# Altium project CoproMKII.PrjPcb
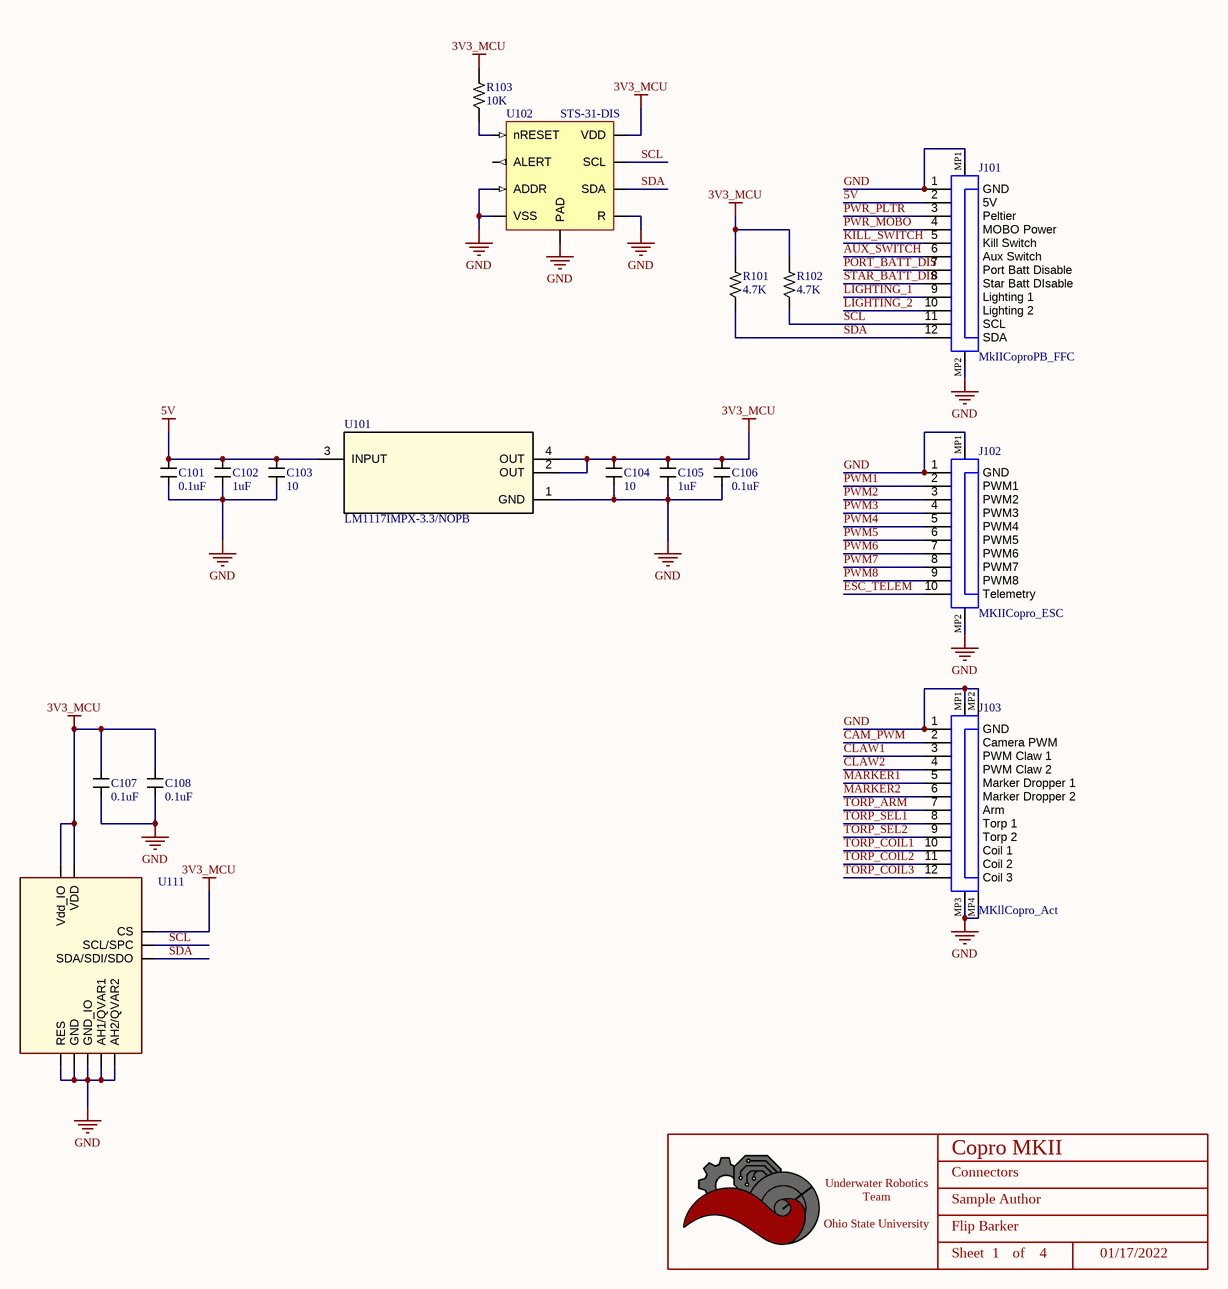
[diagram p0: CoproMKII_Connectors.SchDoc]
BoardRevision: 1.0; DateOfDesignReview: XX/XX/XXXX; ProjectTitle: Copro MKII; TeamLead: Flip Barker
2 sheets, 55 parts. Net scope: global (net labels, ports and power ports of the same name join across sheets).
Board file: CoproMKII.PcbDoc
Sheets:
  CoproMKII_Connectors.SchDoc
  CoproMKII_Ethernet.SchDoc

## Sheet CoproMKII_Connectors.SchDoc: Connectors
size B; Date: 01/17/2022; Author: Sample Author; Organization: ORGANIZATION; Address1: ADDRESS 1; Address2: ADDRESS 2; Address3: ADDRESS 3; Address4: ADDRESS 4; Revision: -; SheetNumber: 1; SheetTotal: 4; ENG_APP_DATE: --/--/--; DSN_APP_DATE: --/--/--; CHK_APP_DATE: --/--/--

### Parts
*  Title_Block  [LOGO]  (value not drawn)  (graphical)
C101  value 0.1uF  [CAPACITOR_0603]  (hidden comment: 100nF Ceramic 6.3V)
C102  value 1uF  [CAPACITOR_0603]  (hidden comment: 1uF Ceramic 16V)
C103  Value (uF): 10  [CAPACITOR_0603]  (hidden comment: 10uF Ceramic 6.3V)
C104  Value (uF): 10  [CAPACITOR_0603]  (hidden comment: 10uF Ceramic 6.3V)
C105  value 1uF  [CAPACITOR_0603]  (hidden comment: 1uF Ceramic 16V)
C106  value 0.1uF  [CAPACITOR_0603]  (hidden comment: 100nF Ceramic 6.3V)
C107  value 0.1uF  [CAPACITOR_0603]  (hidden comment: 100nF Ceramic 6.3V)
C108  value 0.1uF  [CAPACITOR_0603]  (hidden comment: 100nF Ceramic 6.3V)
J101  MkIICoproPB_FFC  [68611214122]
J102  MKIICopro_ESC  [68611014122]
J103  MKllCopro_Act  [686112183822]
R101  Value  (Ohms): 4.7K  [RESISTOR_0805]  (hidden comment: 4.7k Ohm 5% 1/8W)
R102  Value  (Ohms): 4.7K  [RESISTOR_0805]  (hidden comment: 4.7k Ohm 5% 1/8W)
R103  Value  (Ohms): 10K  [RESISTOR_0603]  (hidden comment: 10k Ohm 5% 1/10W)
U101  LM1117IMPX-3.3/NOPB  [SOT-223-4]
U102  STS-31-DIS  [8-TDFN]
U111  ILPS22QSTR  [LGA10R50P2X3_200X200X80]  (value not drawn)

### Nets
3V3_MCU: C104.1 C105.1 C106.1 C107.1 C108.1 R101.1 R102.1 R103.1 U101.2(OUT) U101.4(OUT) U102.5(VDD) U111.1(Vdd_IO) U111.6(CS) U111.10(VDD)
5V: C101.1 C102.1 C103.1 J101.2(5V) U101.3(INPUT)
GND: C101.2 C102.2 C103.2 C104.2 C105.2 C106.2 C107.2 C108.2 J101.1(GND) J101.MP1 J101.MP2 J102.1(GND) J102.MP1 J102.MP2 J103.1(GND) J103.MP1 J103.MP2 J103.MP3 J103.MP4 U101.1(GND) U102.2(ADDR) U102.7(R) U102.8(VSS) U102.9(PAD) U111.3(RES) U111.5(AH2/QVAR2) U111.7(AH1/QVAR1) U111.8(GND_IO) U111.9(GND)
AUX_SWITCH: J101.6(Aux_Switch)
CAM_PWM: J103.2(Camera_PWM)
CLAW1: J103.3(PWM_Claw_1)
CLAW2: J103.4(PWM_Claw_2)
ESC_TELEM: J102.10(Telemetry)
KILL_SWITCH: J101.5(Kill_Switch)
LIGHTING_1: J101.9(Lighting_1)
LIGHTING_2: J101.10(Lighting_2)
MARKER1: J103.5(Marker_Dropper_1)
MARKER2: J103.6(Marker_Dropper_2)
PORT_BATT_DIS: J101.7(Port_Batt_Disable)
PWM1: J102.2(PWM1)
PWM2: J102.3(PWM2)
PWM3: J102.4(PWM3)
PWM4: J102.5(PWM4)
PWM5: J102.6(PWM5)
PWM6: J102.7(PWM6)
PWM7: J102.8(PWM7)
PWM8: J102.9(PWM8)
PWR_MOBO: J101.4(MOBO_Power)
PWR_PLTR: J101.3(Peltier)
SCL: J101.11(SCL) R102.2 U102.4(SCL) U111.2(SCL/SPC)
SDA: J101.12(SDA) R101.2 U102.1(SDA) U111.4(SDA/SDI/SDO)
STAR_BATT_DIS: J101.8(Star_Batt_DIsable)
TORP_ARM: J103.7(Arm)
TORP_COIL1: J103.10(Coil_1)
TORP_COIL2: J103.11(Coil_2)
TORP_COIL3: J103.12(Coil_3)
TORP_SEL1: J103.8(Torp_1)
TORP_SEL2: J103.9(Torp_2)
NetR103_2: R103.2 U102.6(nRESET)

Not connected (* = marked no-connect by the designer): U102 3(ALERT)

### Notes on the sheet
- DWG. NO.
- REV.
- SHT.
- THIS DOCUMENT AND THE DATA DISCLOSED HEREIN OR HEREWITH IS THE PROPERTY OF ALTIUM LIMITED AND MAY BE FREELY DISTRIBUTED IN WHOLE. NO RIGHTS ARE RESERVED OR EXPRESS OR IMPLIED WARANTEE GIVEN.
- REVISION
- DESCRIPTION
- DATE
- APPROVED
- ENG:
- APPROVALS
- PROJECT
- DSN:
- CHK:
- REFERENCE DOCUMENTS
- PROJECT REVISION:
- TITLE
- DOCUMENT REVISION:
- DESIGN ITEM:
- BOM:
- FAB DWG:
- PCB DWG:
- ASSY DWG:
- SCALE:
- SIZE
- B
- CAGE CODE
- FILE NAME
- DWG NO.
- SHEET
- OF
- REV
- (in symbol Title_Block) Underwater Robotics Team / Ohio State University; Sheet; of

### Library data of the parts
* = Title_Block: UWRT Schematic Title Block Template / Created June 2021, Dylan Trainor
C101 C106-C108 = CAPACITOR_0.1uF_0603: Cap 100nF 6.3V +/-10% / Ceramic 0603; Made By: Flip B; ComponentLink1Description: Datsheet; ComponentLink1URL: https://www.mouser.com/datasheet/2/212/KEM_C1002_X7R_SMD-1102033.pdf; Tolerance: +/- 10%; Voltage: 6.3V; Supplier 1: Digi-Key; Supplier Part Number 1: 399-15351-1-ND
C102 C105 = CAPACITOR_1uF_0603: Cap 1uF 16V +/-10% / Ceramic 0603; Made By: Flip B; Tolerance: +/- 10%; Voltage: 16V; Supplier 1: Digi-Key; Supplier Part Number 1: 399-7847-1-ND
C103 C104 = CAPACITOR_10uF_0603: Cap 10uF 6.3V +/-20% / Ceramic 0603; Made By: Flip B; ComponentLink1Description: Digikey; ComponentLink1URL: https://www.digikey.com/en/products/detail/samsung-electro-mechanics/CL10A106MQ8NNNC/3886777; Supplier 1: Digi-Key; Supplier Part Number 1: 1276-1119-1-ND; Tolerance: +/- 20%; Voltage: 6.3V
J101 = MkIICoproPB_FFC: WR-FPC SMT ZIF Horizontal Top Contact, pitch 1mm, 12p; Manufacturer: Wurth Elektronik; Contact Resistance: 20mOhm; Pin Number: 12; Working Voltage: 125VAC; Rated Current: 1A; ComponentLink1Description: Manufacturer; ComponentLink1URL: http://www.we-online.de; ComponentLink2Description: Datasheet; ComponentLink2URL: https://katalog.we-online.com/em/datasheet/68611214122.pdf; Packaging: Tape and Reel; Pitch: 1mm; Published Date: March 2021; Mounting Technology: SMT; Operating Temperature: -25 to +85degC; Length: 19mm; Manufacturer Part Number: 68611214122; Type: Horizontal
J102 = MKIICopro_ESC: WR-FPC SMT ZIF Horizontal Top Contact, pitch 1mm, 10p; Manufacturer: Wurth Elektronik; Contact Resistance: 20mOhm; Pin Number: 10; Working Voltage: 125VAC; Rated Current: 1A; ComponentLink1Description: Manufacturer; ComponentLink1URL: http://www.we-online.de; ComponentLink2Description: Datasheet; ComponentLink2URL: https://katalog.we-online.com/em/datasheet/68611014122.pdf; Packaging: Tape and Reel; Pitch: 1mm; Published Date: March 2021; Mounting Technology: SMT; Operating Temperature: -25 to +85degC; Length: 17mm; Manufacturer Part Number: 68611014122; Type: Horizontal
J103 = MKllCopro_Act: WR-FPC SMT ZIF Vertical Type A, pitch 1mm, 12p; Manufacturer: Wurth Elektronik; Contact Resistance: 30mOhm; Pin Number: 12; Working Voltage: 125VAC; Rated Current: 1A; ComponentLink1Description: Manufacturer; ComponentLink1URL: http://www.we-online.de; ComponentLink2Description: Datasheet; ComponentLink2URL: https://katalog.we-online.com/em/datasheet/686112183822.pdf; Packaging: Tape and Reel; Pitch: 1mm; Published Date: March 2021; Mounting Technology: SMT; Operating Temperature: -25 to +85degC; Length: 18.8mm; Manufacturer Part Number: 686112183822; Type: Vertical
R101 R102 = RESISTOR_4.7K_0805: RES 4.7k OHM 5% 1/8W 0805; Tolerance: +/- 5%; Made By: Robert Pafford; ComponentLink1Description: Datasheet; Wattage: 1/8W; Supplier: Digikey; Digikey Part Numer: CR0603-JW-104ELFTR-ND
R103 = RESISTOR_10K_0603: RES 10k OHM 5% 1/10W 0603; Tolerance: +/- 5%; Wattage: 1/8W; Made By: Robert Pafford; ComponentLink1Description: Datasheet; ComponentLink1URL: https://www.bourns.com/docs/product-datasheets/CRxxxxx.pdf; Supplier: Digikey; Digikey Part Numer: CR0603-JW-104ELFTR-ND; Supplier 1: Digi-Key; Supplier Part Number 1: 2019-RK73B1JTTD103JCT-ND
U101 = LM1117IMPX-3.3/NOPB: IC REG LIN 3.3V 800MA SOT223-4; PartNumber: LM1117IMP-3.3/NOPB; Manufacturer: Texas Instruments; Vin (Max): 15V; Supplier 1: Digi-Key; Supplier Part Number 1: LM1117IMPX-3.3/NOPBCT-ND; Vout (Min/Fixed): 3.3V; Amp Out: 800mA; Package: SOT-223-4; Created By: Dylan T
U102 = STS-31-DIS: Temperature Sensor Digital, Local 0°C ~ 90°C 16 b 8-TDFN (2.5x2.5); Accuracy: ±0.2°C; Operating Range: -40°C ~ 125°C; Interface: I2C; Resolution: 16b; Operating Voltage: 2.15V ~ 5.5V; Made By: Robert Pafford; Supplier 1: Digi-Key; Supplier Part Number 1: 1649-1064-1-ND; Accuracy Range: 0°C ~ 90°C
U111 = ILPS22QSTR: Board Mount Pressure Sensors Dual full-scale 1260hPa 4060hPa absolute digital output barometer embedded Qvar. I2C and SPI; Supplier 1: Mouser; Supplier Part Number 1: 511-ILPS22QSTR

## Sheet CoproMKII_Ethernet.SchDoc
size B; SheetNumber: 4; SheetTotal: 4
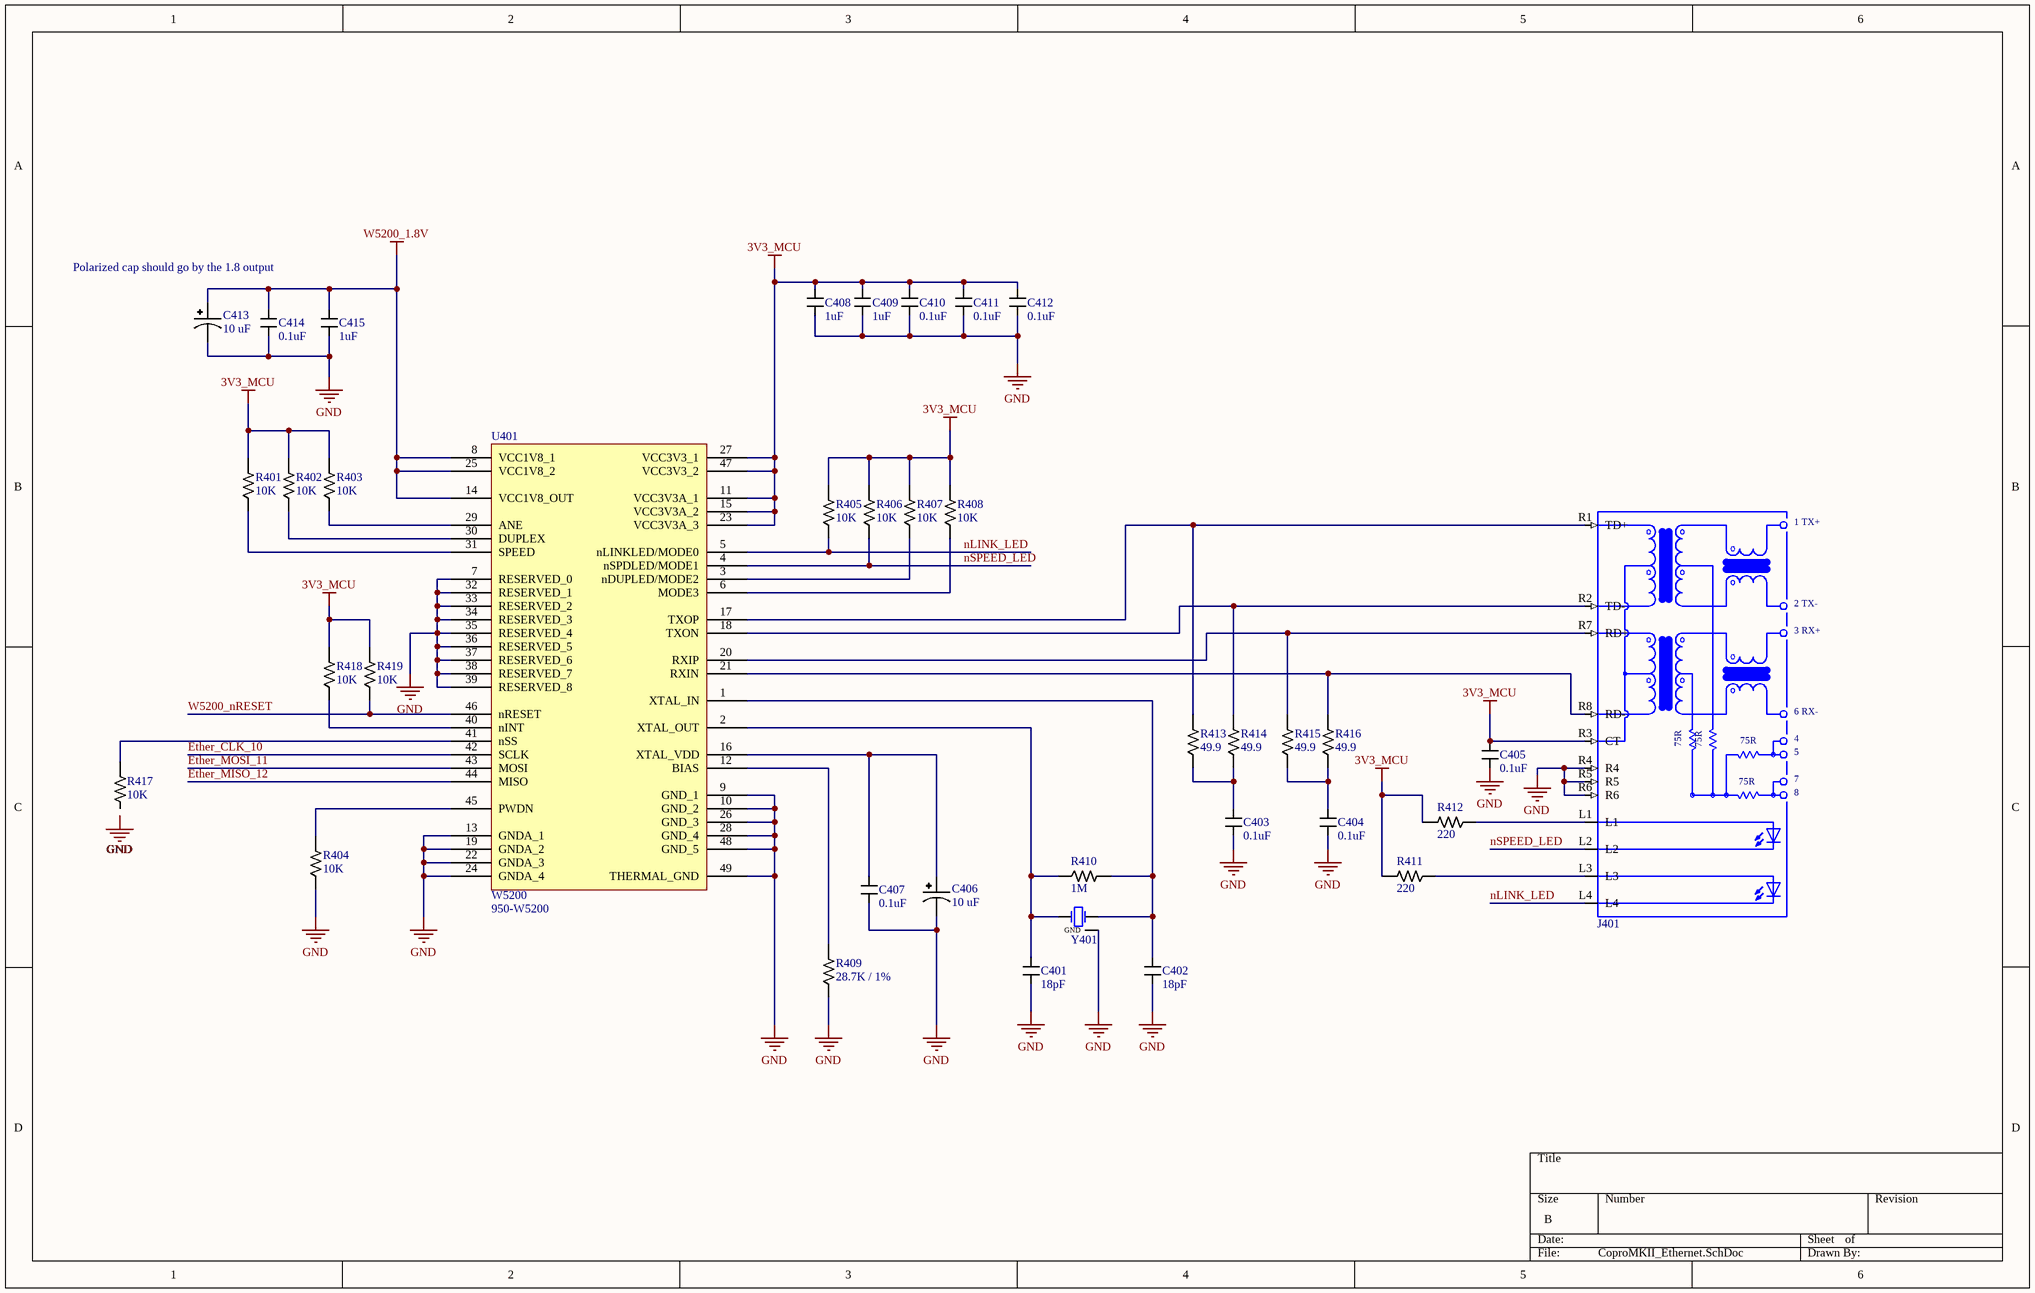
[diagram p1: CoproMKII_Ethernet.SchDoc]

### Parts
C401  value 18pF  [CAPACITOR_0603]  (hidden comment: 18pF Ceramic 50V)
C402  value 18pF  [CAPACITOR_0603]  (hidden comment: 18pF Ceramic 50V)
C403  value 0.1uF  [CAPACITOR_0603]  (hidden comment: 100nF Ceramic 6.3V)
C404  value 0.1uF  [CAPACITOR_0603]  (hidden comment: 100nF Ceramic 6.3V)
C405  value 0.1uF  [CAPACITOR_0603]  (hidden comment: 100nF Ceramic 6.3V)
C406  Value (uF): 10 uF  [CAPACITOR_0603]  (hidden comment: 10uF Tantalum 10V)
C407  value 0.1uF  [CAPACITOR_0603]  (hidden comment: 100nF Ceramic 6.3V)
C408  value 1uF  [CAPACITOR_0603]  (hidden comment: 1uF Ceramic 16V)
C409  value 1uF  [CAPACITOR_0603]  (hidden comment: 1uF Ceramic 16V)
C410  value 0.1uF  [CAPACITOR_0603]  (hidden comment: 100nF Ceramic 6.3V)
C411  value 0.1uF  [CAPACITOR_0603]  (hidden comment: 100nF Ceramic 6.3V)
C412  value 0.1uF  [CAPACITOR_0603]  (hidden comment: 100nF Ceramic 6.3V)
C413  Value (uF): 10 uF  [CAPACITOR_0603]  (hidden comment: 10uF Tantalum 10V)
C414  value 0.1uF  [CAPACITOR_0603]  (hidden comment: 100nF Ceramic 6.3V)
C415  value 1uF  [CAPACITOR_0603]  (hidden comment: 1uF Ceramic 16V)
J401  Ethernet Connector  [WIZNET_RB1-125BAG1A]  (value not drawn)
R401  Value  (Ohms): 10K  [RESISTOR_0603]  (hidden comment: 10k Ohm 5% 1/10W)
R402  Value  (Ohms): 10K  [RESISTOR_0603]  (hidden comment: 10k Ohm 5% 1/10W)
R403  Value  (Ohms): 10K  [RESISTOR_0603]  (hidden comment: 10k Ohm 5% 1/10W)
R404  Value  (Ohms): 10K  [RESISTOR_0603]  (hidden comment: 10k Ohm 5% 1/10W)
R405  Value  (Ohms): 10K  [RESISTOR_0603]  (hidden comment: 10k Ohm 5% 1/10W)
R406  Value  (Ohms): 10K  [RESISTOR_0603]  (hidden comment: 10k Ohm 5% 1/10W)
R407  Value  (Ohms): 10K  [RESISTOR_0603]  (hidden comment: 10k Ohm 5% 1/10W)
R408  Value  (Ohms): 10K  [RESISTOR_0603]  (hidden comment: 10k Ohm 5% 1/10W)
R409  Value  (Ohms): 28.7K / 1%  [RESISTOR_0603]  (hidden comment: K / 1%)
R410  1M  [RESISTOR_0603]
R411  Value  (Ohms): 220  [RESISTOR_0603]  (hidden comment: 220 Ohm 5% 1/8W)
R412  Value  (Ohms): 220  [RESISTOR_0603]  (hidden comment: 220 Ohm 5% 1/8W)
R413  Value  (Ohms): 49.9  [RESISTOR_0603]  (hidden comment: 49.9 Ohm 1% 1/8W)
R414  Value  (Ohms): 49.9  [RESISTOR_0603]  (hidden comment: 49.9 Ohm 1% 1/8W)
R415  Value  (Ohms): 49.9  [RESISTOR_0603]  (hidden comment: 49.9 Ohm 1% 1/8W)
R416  Value  (Ohms): 49.9  [RESISTOR_0603]  (hidden comment: 49.9 Ohm 1% 1/8W)
R417  Value  (Ohms): 10K  [RESISTOR_0603]  (hidden comment: 10k Ohm 5% 1/10W)
R418  Value  (Ohms): 10K  [RESISTOR_0603]  (hidden comment: 10k Ohm 5% 1/10W)
R419  Value  (Ohms): 10K  [RESISTOR_0603]  (hidden comment: 10k Ohm 5% 1/10W)
U401  W5200  Supplier Part Number 1: 950-W5200  [QFN-48]
Y401  CRYSTAL 12.0000MHZ 18PF SMD  [4-SMD No Lead Crystal]  (value not drawn)

### Nets
3V3_MCU: C405.1 C408.1 C409.1 C410.1 C411.1 C412.1 J401.R3(CT) R401.1 R402.1 R403.1 R405.1 R406.1 R407.1 R408.1 R411.1 R412.1 R418.1 R419.1 U401.11(VCC3V3A_1) U401.15(VCC3V3A_2) U401.23(VCC3V3A_3) U401.27(VCC3V3_1) U401.47(VCC3V3_2)
GND: C401.2 C402.2 C403.2 C404.2 C405.2 C406.2 C407.2 C408.2 C409.2 C410.2 C411.2 C412.2 C413.2 C414.2 C415.2 J401.R4 J401.R5 J401.R6 R404.2 R409.2 U401.7(RESERVED_0) U401.9(GND_1) U401.10(GND_2) U401.13(GNDA_1) U401.19(GNDA_2) U401.22(GNDA_3) U401.24(GNDA_4) U401.26(GND_3) U401.28(GND_4) U401.32(RESERVED_1) U401.33(RESERVED_2) U401.34(RESERVED_3) U401.35(RESERVED_4) U401.36(RESERVED_5) U401.37(RESERVED_6) U401.38(RESERVED_7) U401.39(RESERVED_8) U401.48(GND_5) U401.49(THERMAL_GND) Y401.GND
W5200_1.8V: C413.1 C414.1 C415.1 U401.8(VCC1V8_1) U401.14(VCC1V8_OUT) U401.25(VCC1V8_2)
Ether_CLK_10: U401.42(SCLK)
Ether_MISO_12: U401.44(MISO)
Ether_MOSI_11: U401.43(MOSI)
nLINK_LED: J401.L4 R405.2 U401.5(nLINKLED/MODE0)
nSPEED_LED: J401.L2 R406.2 U401.4(nSPDLED/MODE1)
W5200_nRESET: R419.2 U401.46(nRESET)
NetC401_1: C401.1 R410.2 U401.2(XTAL_OUT) Y401.1
NetC402_1: C402.1 R410.1 U401.1(XTAL_IN) Y401.2
NetC403_1: C403.1 R413.2 R414.2
NetC404_1: C404.1 R415.2 R416.2
NetC406_1: C406.1 C407.1 U401.16(XTAL_VDD)
NetJ401_L1: J401.L1 R412.2
NetJ401_L3: J401.L3 R411.2
NetJ401_R1: J401.R1(TD+) R413.1 U401.17(TXOP)
NetJ401_R2: J401.R2(TD-) R414.1 U401.18(TXON)
NetJ401_R7: J401.R7(RD+) R415.1 U401.20(RXIP)
NetJ401_R8: J401.R8(RD-) R416.1 U401.21(RXIN)
NetR401_2: R401.2 U401.31(SPEED)
NetR402_2: R402.2 U401.30(DUPLEX)
NetR403_2: R403.2 U401.29(ANE)
NetR404_1: R404.1 U401.45(PWDN)
NetR407_2: R407.2 U401.3(nDUPLED/MODE2)
NetR408_2: R408.2 U401.6(MODE3)
NetR409_1: R409.1 U401.12(BIAS)
NetR417_1: R417.1 U401.41(nSS)
NetR418_2: R418.2 U401.40(nINT)

Not connected (* = marked no-connect by the designer): R417 2

### Notes on the sheet
- Polarized cap should go by the 1.8 output
- (in symbol RB1-125BAG1A) 1 TX+; 2 TX-; 3 RX+; 6 RX-; 75R; 4; 5; 7; 8

### Library data of the parts
C401 C402 = CAPACITOR_0.000018uF_0603: Cap 18pF 50V +/-5% / Ceramic 0603; Made By: Flip B; ComponentLink1Description: Datsheet; ComponentLink1URL: https://www.mouser.com/datasheet/2/212/KEM_C1002_X7R_SMD-1102033.pdf; Tolerance: +/- 5%; Voltage: 50V; Supplier 1: Digi-Key; Supplier Part Number 1: 311-1061-1-ND
C403-C405 C407 C410-C412 C414 = CAPACITOR_0.1uF_0603: as C101 on sheet CoproMKII_Connectors; ComponentLink1Description: Datsheet; ComponentLink1URL: https://www.mouser.com/datasheet/2/212/KEM_C1002_X7R_SMD-1102033.pdf; Tolerance: +/- 10%; Voltage: 6.3V; Supplier 1: Digi-Key; Supplier Part Number 1: 399-15351-1-ND
C406 C413 = CAPACITOR_10uF_0603_Tantalum: Cap 10uF 10V +/-20% / Tantalum 0603; Made By: John S; ComponentLink1Description: Digikey; ComponentLink1URL: https://www.digikey.com/en/products/detail/kyocera-avx/F981A106MMA/4004990; Tolerance: +/- 20%; Voltage: 10V
C408 C409 C415 = CAPACITOR_1uF_0603: as C102 on sheet CoproMKII_Connectors; Tolerance: +/- 10%; Voltage: 16V; Supplier 1: Digi-Key; Supplier Part Number 1: 399-7847-1-ND
J401 = RB1-125BAG1A: CONN JACK 1PORT 100 BASE-T PCB
R401-R408 R417-R419 = RESISTOR_10K_0603: as R103 on sheet CoproMKII_Connectors; ComponentLink1Description: Datasheet; ComponentLink1URL: https://www.bourns.com/docs/product-datasheets/CRxxxxx.pdf; Supplier: Digikey; Digikey Part Numer: CR0603-JW-104ELFTR-ND; Supplier 1: Digi-Key; Supplier Part Number 1: 2019-RK73B1JTTD103JCT-ND
R409 = RESISTOR_28.7K / 1%_0603: RES 28.7K OHM 1% 1/8W 0603; Tolerance: +/- 5%; Made By: Robert Pafford; ComponentLink1Description: Datasheet; ComponentLink1URL: https://www.bourns.com/docs/product-datasheets/CRxxxxx.pdf; Wattage: 1/8W; Supplier: Digikey; Digikey Part Numer: CR0603-JW-104ELFTR-ND; Supplier 1: Digi-Key; Supplier Part Number 1: 541-28.7KHCT-ND
R410 = RESISTOR_1M_0603: RES 1M OHM 1/8W 0603; Tolerance: +/- 5%; Made By: Robert Pafford; ComponentLink1Description: Datasheet; ComponentLink1URL: https://www.bourns.com/docs/product-datasheets/CRxxxxx.pdf; Wattage: 1/8W; Supplier: Digikey; Digikey Part Numer: CR0603-JW-104ELFTR-ND; Supplier 1: Digi-Key; Supplier Part Number 1: RMCF0603JT1M00CT-ND; Value  (Ohms): 1M
R411 R412 = RESISTOR_200_0603: RES 220 OHM 5% 1/8W 0603; Tolerance: +/- 5%; Made By: John S; ComponentLink1Description: Digikey; ComponentLink1URL: https://www.digikey.com/en/products/detail/koa-speer-electronics-inc/RK73B1JTTD101J/9844701; Wattage: 1/8W; Supplier 1: Digi-Key; Supplier Part Number 1: 2019-RK73B1JTTD221JCT-ND
R413-R416 = RESISTOR_49.9_0603: RES 49.9 OHM 1% 1/8W 0603; Tolerance: +/- 1%; Made By: John S; ComponentLink1Description: Datasheet; ComponentLink1URL: https://www.bourns.com/docs/product-datasheets/CRxxxxx.pdf; Wattage: 1/8W; Supplier: Digikey; Supplier 1: Digi-Key; Supplier Part Number 1: RNCP0603FTD49R9CT-ND
U401 = W5200: WIZNET W5200 / 48QFN (7x7 mm); MF: Texas Instruments; MP: LM1117IMPX-3.3/NOPB; Created by:: Siddharth.V; Texas_Instruments-Purchase-URL: https://snapeda.com/shop?store=Texas+Instruments&id=410186; Price: None; Mouser-Purchase-URL: https://snapeda.com/shop?store=Mouser&id=410186; Value: *; Availability: Good; Package: SOT-223-4 Texas Instruments; Arrow_Electronics-Purchase-URL: https://snapeda.com/shop?store=Arrow+Electronics&id=410186; SnapEDA_Link: https://www.snapeda.com/parts/LM1117IMPX-3.3/NOPB/Texas%20Instruments/view-part/410186/?ref=snap; DigiKey-Purchase-URL: https://snapeda.com/shop?store=DigiKey&id=410186; ComponentLink1Description: Datasheet; ComponentLink1URL: https://www.wiznet.io/product-item/w5200/; Supplier 1: Mouser
Y401 = CRYSTAL_25MHz_SMD_1: 25 MHz ±20ppm Crystal 18pF; pin to pad: 2>3 GND>2+4; Made By: Robert Pafford; Frequency: 12 MHz; ESR: 50 Ohmz; Load Capacitance: 18pF; Supplier 1: Digi-Key; Supplier Part Number 1: 2151-AS-25.000-18-F-EXT-ND

## Nets that join several sheets
3V3_MCU: CoproMKII_Connectors (14 pins), CoproMKII_Ethernet (23 pins)
GND: CoproMKII_Connectors (29 pins), CoproMKII_Ethernet (40 pins)